# EAGLE design WatchX-BASIC-BOTTOM (EAGLE 9.6.2)
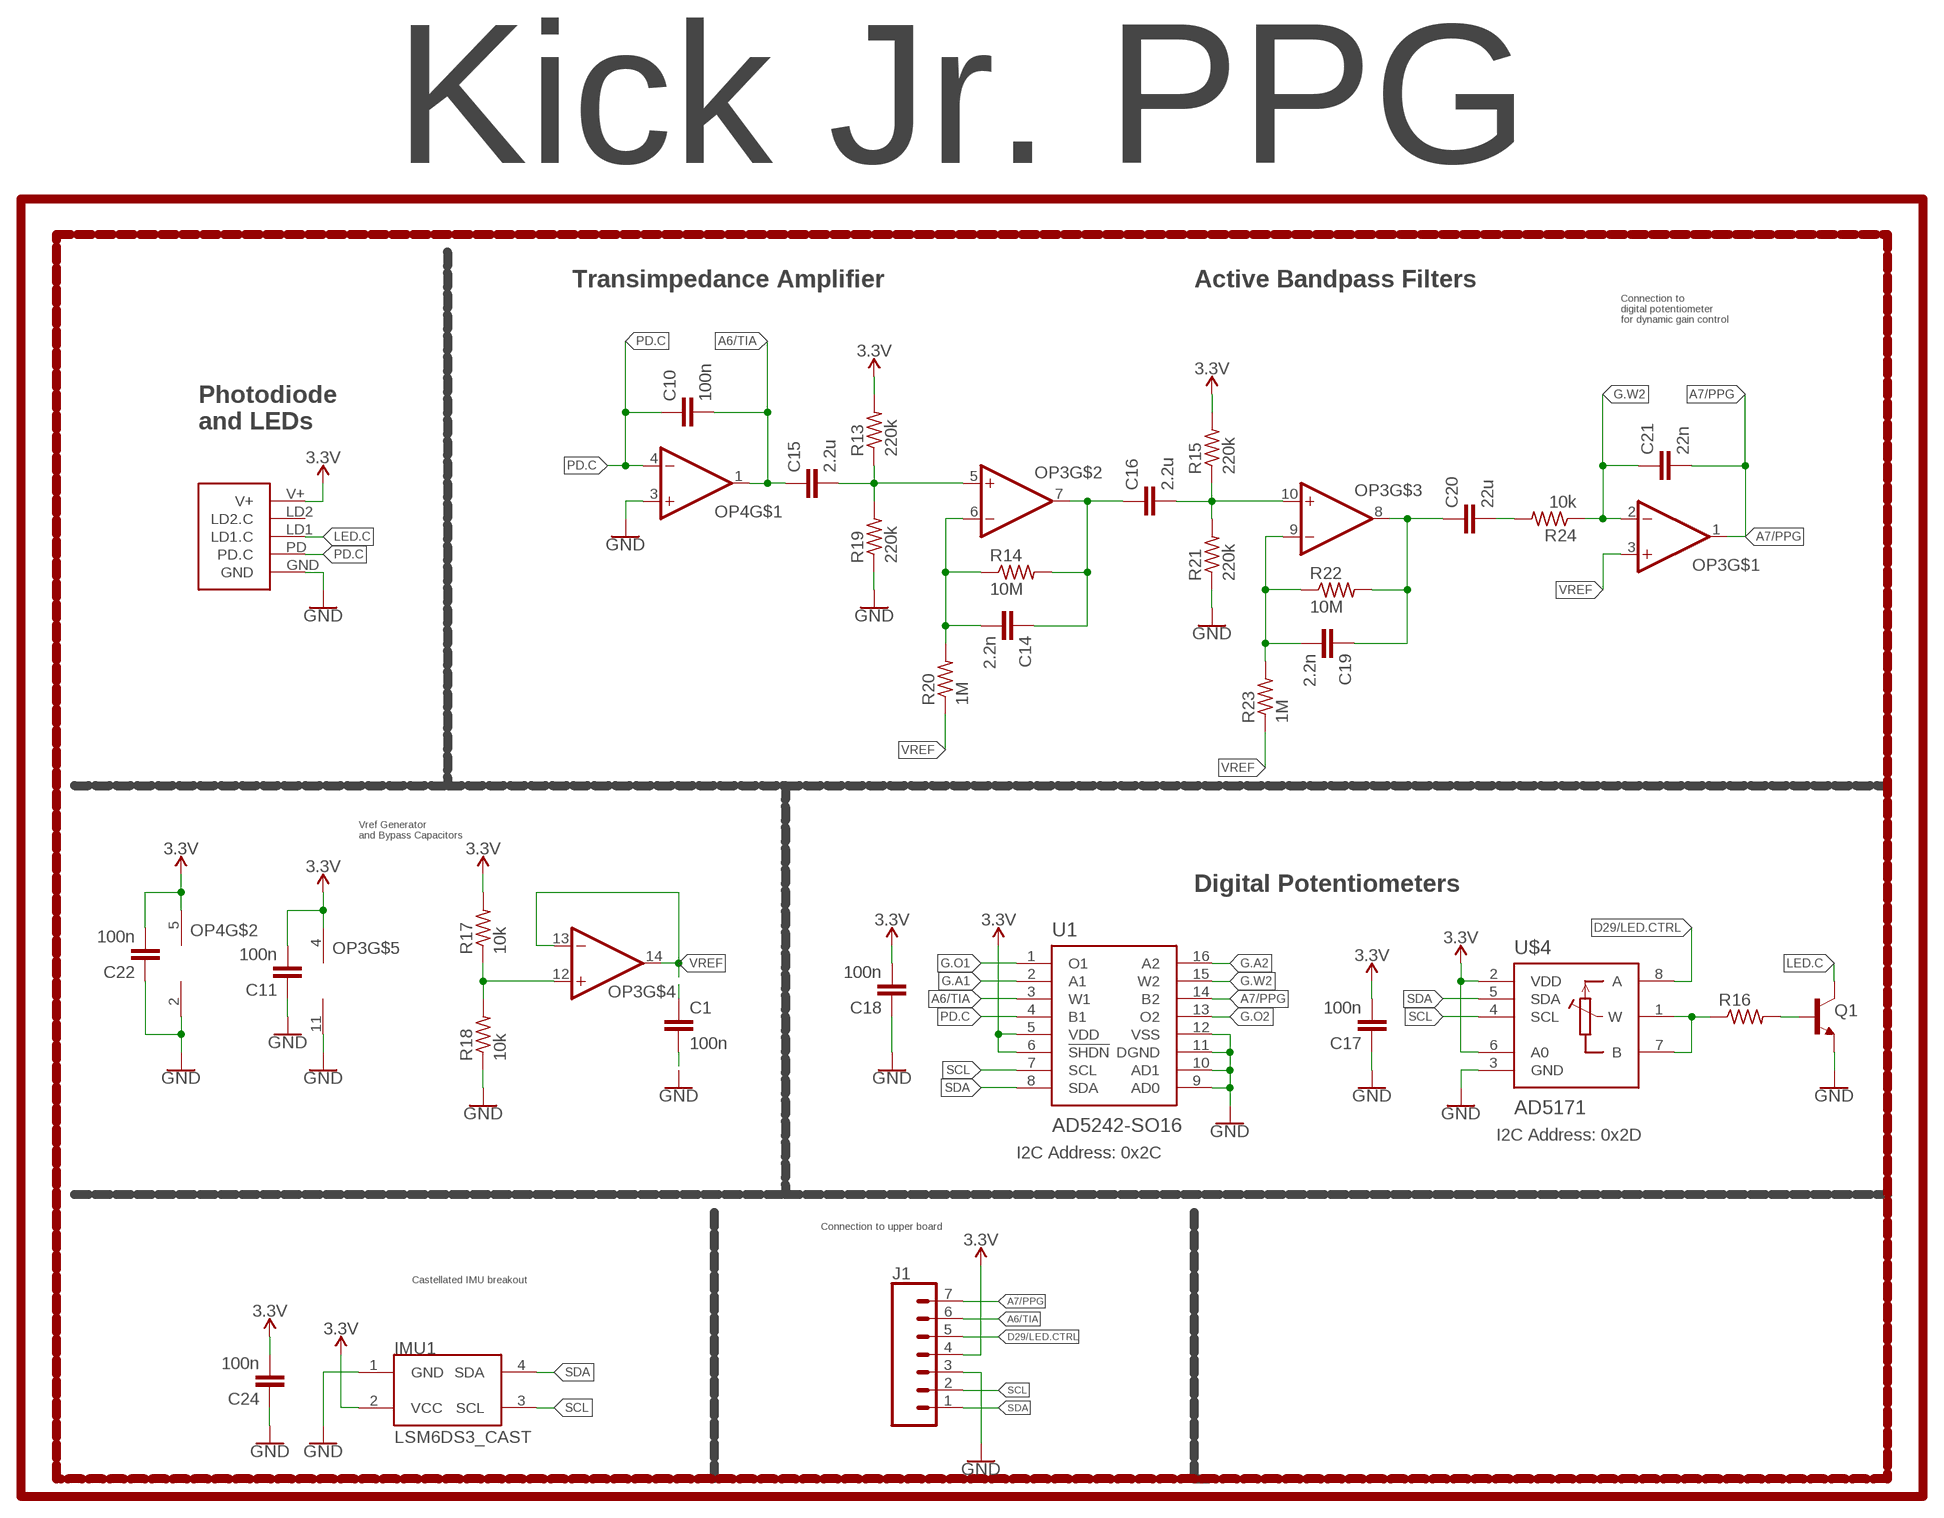
[diagram p0: schematic, sheet 1]

## Parts
C1  100n  CAPACITOR0603  [C0603]
C10  100n  CAPACITOR0603  [C0603]
C11  100n  CAPACITOR0603  [C0603]
C14  2.2n  CAPACITOR0603  [C0603]
C15  2.2u  CAPACITOR0603  [C0603]
C16  2.2u  CAPACITOR0603  [C0603]
C17  100n  CAPACITOR0603  [C0603]
C18  100n  CAPACITOR0603  [C0603]
C19  2.2n  CAPACITOR0603  [C0603]
C20  22u  CAPACITOR0603  [C0603]
C21  22n  CAPACITOR0603  [C0603]
C22  100n  CAPACITOR0603  [C0603]
C24  100n  CAPACITOR0603  [C0603]
IMU1  LSM6DS3_CAST  [LSM6DS3_CAST]
J1  CONN_07-1.27MM  [1X07_1.27MM]
OP3  OP-QUAD-SO14  [SO14]
OP4  OP-SINGLEOT  [SOT23-5]
Q1  NPN-GENERIC  [SOT23-3]
R13  220k  RESISTOR0603  [R0603]
R14  10M  RESISTOR0603  [R0603]
R15  220k  RESISTOR0603  [R0603]
R16  RESISTOR0603  [R0603]
R17  10k  RESISTOR0402  [R0402]
R18  10k  RESISTOR0402  [R0402]
R19  220k  RESISTOR0603  [R0603]
R20  1M  RESISTOR0603  [R0603]
R21  220k  RESISTOR0603  [R0603]
R22  10M  RESISTOR0603  [R0603]
R23  1M  RESISTOR0603  [R0603]
R24  10k  RESISTOR0603  [R0603]
U1  AD5242-SO16  [SO16]
U$3  PPG.MODULE.2  [PPG.MODULE.2]
U$4  AD5171  [SOT-23-8]

## Nets
3.3V: C11.2 C17.2 C18.2 C22.2 C24.2 IMU1.2(VCC) J1.4 OP3.4(V+) OP4.5(V+) R13.2 R15.2 R17.2 U1.5(VDD) U1.6(!SHDN) U$3.V+ U$4.2(VDD) U$4.6(A0)
A6/TIA: C10.2 C15.1 J1.6 OP4.1(OUT) U1.3(W1)
A7/PPG: C21.2 J1.7 OP3.1(OUT) U1.14(B2)
D29/LED.CTRL: J1.5 U$4.8(A)
G.A1: U1.2(A1)
G.A2: U1.16(A2)
G.O1: U1.1(O1)
G.O2: U1.13(O2)
G.W2: C21.1 OP3.2(-IN) R24.1 U1.15(W2)
GND: C1.2 C11.1 C17.1 C18.1 C22.1 C24.1 IMU1.1(GND) J1.3 OP3.11(V-) OP4.2(V-) OP4.3(+IN) Q1.2(E) R18.1 R19.1 R21.1 U1.9(AD0) U1.10(AD1) U1.11(DGND) U1.12(VSS) U$3.GND U$4.3(GND)
LED.C: Q1.3(C) U$3.LD1(LD1.C)
N$8: Q1.1(B) R16.2
N$9: R16.1 U$4.1(W) U$4.7(B)
N$10: OP3.12(+IN) R17.1 R18.2
N$13: C15.2 OP3.5(+IN) R13.1 R19.2
N$15: C14.2 OP3.6(-IN) R14.1 R20.2
N$16: C14.1 C16.1 OP3.7(OUT) R14.2
N$17: C16.2 OP3.10(+IN) R15.1 R21.2
N$18: C19.2 OP3.9(-IN) R22.1 R23.2
N$19: C19.1 C20.1 OP3.8(OUT) R22.2
N$20: C20.2 R24.2
PD.C: C10.1 OP4.4(-IN) U1.4(B1) U$3.PD(PD.C)
SCL: IMU1.3(SCL) J1.2 U1.7(SCL) U$4.4(SCL)
SDA: IMU1.4(SDA) J1.1 U1.8(SDA) U$4.5(SDA)
VREF: C1.1 OP3.3(+IN) OP3.13(-IN) OP3.14(OUT) R20.1 R23.1
Unconnected: U$3.LD2(LD2.C)

## Notes on the sheet
- Kick Jr. PPG
- Transimpedance Amplifier | Active Bandpass Filters
- Connection to 
  digital potentiometer
  for dynamic gain control
- Photodiode
  and LEDs
- Vref Generator 
  and Bypass Capacitors
- Digital Potentiometers
- I2C Address: 0x2D
- I2C Address: 0x2C
- Connection to upper board
- Castellated IMU breakout

## Library data of the parts
C1 C10 C11 C14-C22 C24 = LinnesLab-Passives:CAPACITOR
IMU1 = LinnesLab-Sensors:LSM6DS3_CAST
J1 = LinnesLab-Connectors:CONN_07: Multi connection point. Often used as Generic Header-pin footprint for 0.1 inch spaced/style header connections On any of the 0.1 inch spaced packages, you can populate with these: Break Away Headers - Straight <https://www.sparkfun.com/products/116> (PRT-00116) Break Away Male Headers - Right Angle <https://www.sparkfun.com/products/553> (PRT-00553) Female Headers <https://www.sparkfun.com/products/115> (PRT-00115) Break Away Headers - Machine Pin <https://www.sparkfun.com/products/117> (PRT-00117) Break Away Female Headers - Swiss Machine Pin <https://www.sparkfun.com/products/743> (PRT-00743) For SCREWTERMINALS and SPRING TERMINALS visit here: Screw Terimnals on SparkFun.com <https://www.sparkfun.com/search/results?term=Screw+Terminals> (5mm/3.5mm/2.54mm spacing) This device is also useful as a general connection point to wire up your design to another part of your project. Our various solder wires solder well into these plated through hole pads. Hook-Up Wire - Assortment (Stranded, 22 AWG) <https://www.sparkfun.com/products/11375> (PRT-11375) Hook-Up Wire - Assortment (Solid Core, 22 AWG) <https://www.sparkfun.com/products/11367> (PRT-11367) View the entire wire category on our website here <https://www.sparkfun.com/categories/141> Special notes: Molex polarized connector foot print use with SKU : PRT-08231 with associated crimp pins and housings. 1MM SMD Version SKU: PRT-10208 NOTES ON THE VARIANTS LOCK and LOCK_LONGPADS... This footprint was designed to help hold the alignment of a through-hole component (i.e. 6-pin header) while soldering it into place. You may notice that each hole has been shifted either up or down by 0.005 of an inch from it's more standard position (which is a perfectly straight line). This slight alteration caused the pins (the squares in the middle) to touch the edges of the holes. Because they are alternating, it causes a "brace" to hold the component in place. 0.005 has proven to be the perfect amount of "off-center" position when using our standard breakaway headers. Although looks a little odd when you look at the bare footprint, once you have a header in there, the alteration is very hard to notice. Also,if you push a header all the way into place, it is covered up entirely on the bottom side.
OP3 = LinnesLab-AnalogIC:OP-QUAD: General symbol and footprints for Quad Op Amps. Use with any standard general purpose op amp.
OP4 = LinnesLab-AnalogIC:OP-SINGLE: Single Op Amp 2.7V to 6.0V Single Supply CMOS Source: http://ww1.microchip.com/downloads/en/DeviceDoc/21314g.pdf
Q1 = LinnesLab-DiscreteSemi:NPN
R13-R24 = LinnesLab-Passives:RESISTOR
U1 = LinnesLab-DigitalIC:AD5242
U$3 = LinnesLab-Connectors:PPG.MODULE.2: Digi-Key Part Number: S9014E-50-ND Manufacturer Part Number: GRPB501VWVN-RC Description: 1mm insulation height 0.05in pitch 50 positions
U$4 = LinnesLab-DigitalIC:AD5171

## Board
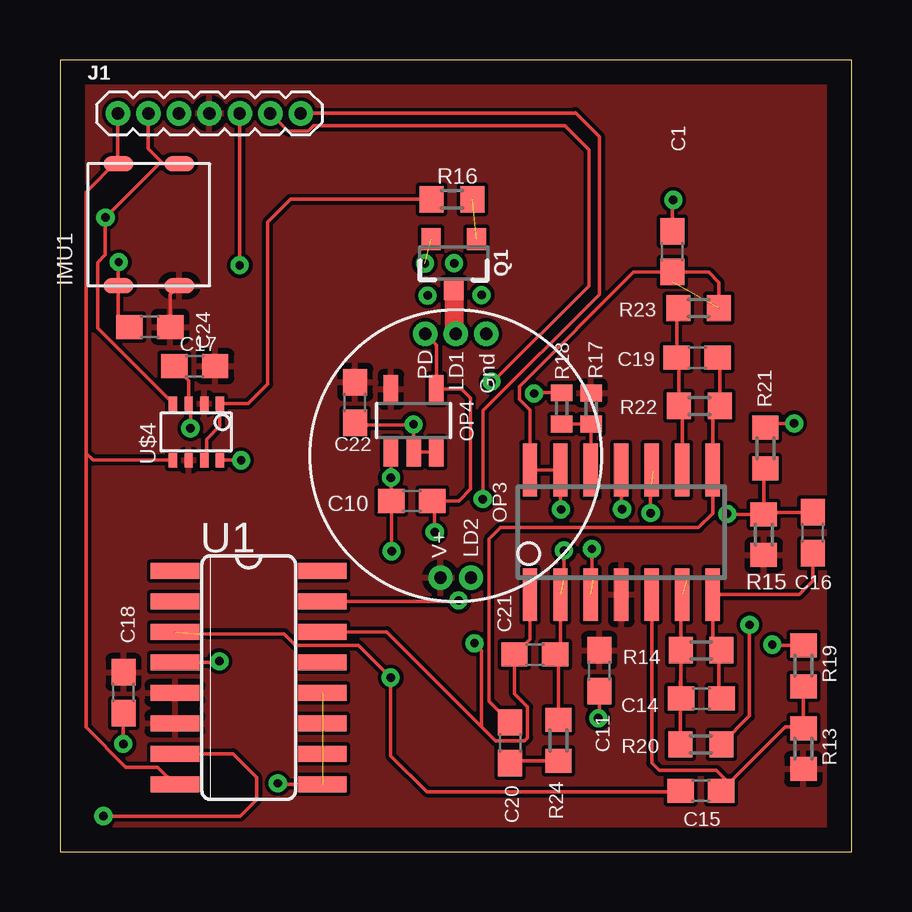
[diagram p1: board, top side]
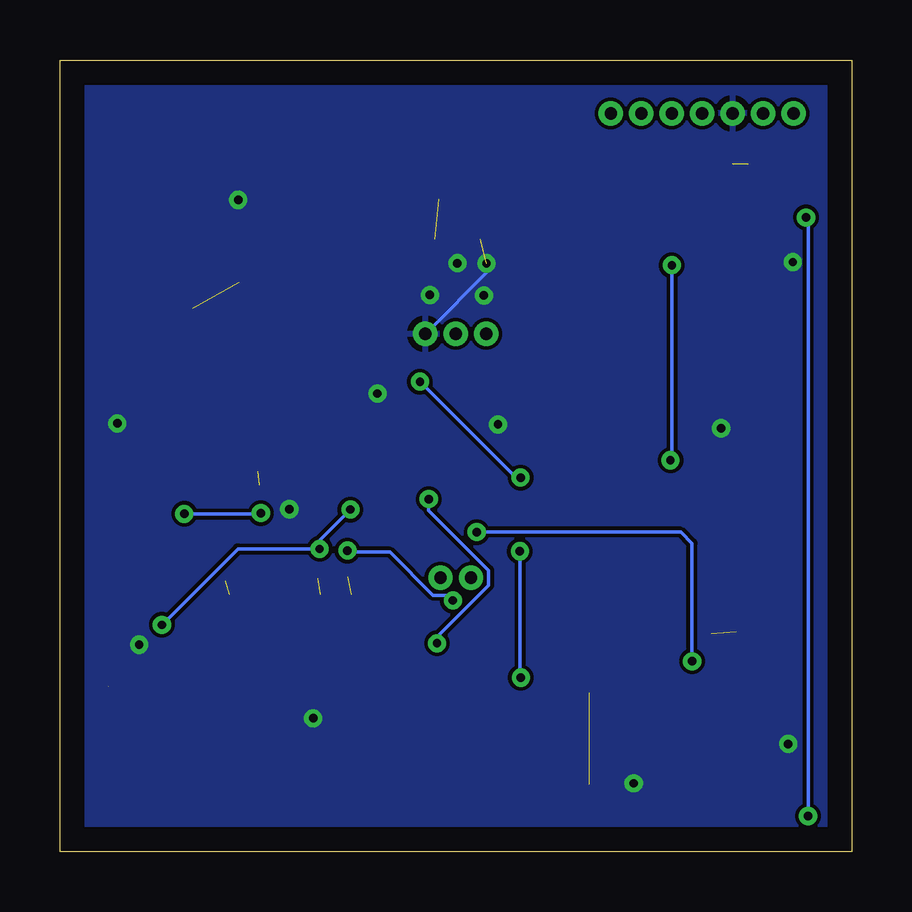
[diagram p2: board, bottom side, seen from below]

Size 33 x 33 mm. Coordinates in mm from the lower left corner, seen from the top.
Outline: 0,0 33,0 33,33 0,33 0,0
Copper layers (1*16): Top 0.035mm / dielectric 1.5mm / Bottom 0.035mm
Design rules "default": minimum track width 6mil, minimum drill 0.35mm, track to track 6mil, track to pad 6mil, pad to pad 6mil, via to via 6mil, smd to smd 6mil, copper to edge 40mil, drill to drill 6mil, minimum pad ring 10mil, minimum via ring 8mil, stop-mask expansion 4mil, vias tented up to drill 0mil, thermal gap 10mil

### Footprints (pad centres in the part's own frame; a part is rotated, then mirrored left to right if it is on the bottom)
C0603 = smd 1.1 x 1: 1 -0.85,0; 2 0.85,0
LSM6DS3_CAST = smd 0.635 x 1.27: 1 -2.54,1.27; 2 -2.54,-1.27; 3 2.54,-1.27; 4 2.54,1.27
1X07_1.27MM = drill 0.508 pad 1: 1 0,0; 2 1.27,0; 3 2.54,0; 4 3.81,0; 5 5.08,0; 6 6.35,0; 7 7.62,0
SO14 = smd 0.6 x 2.2: 1 -3.81,-2.6; 2 -2.54,-2.6; 3 -1.27,-2.6; 4 0,-2.6; 5 1.27,-2.6; 6 2.54,-2.6; 7 3.81,-2.6; 8 3.81,2.6; 9 2.54,2.6; 10 1.27,2.6; 11 0,2.6; 12 -1.27,2.6; 13 -2.54,2.6; 14 -3.81,2.6
SOT23-5 = smd 0.6 x 1.2: 1 -0.95,-1.306; 2 0,-1.306; 3 0.95,-1.306; 4 0.95,1.306; 5 -0.95,1.306
SOT23-3 = smd 0.8 x 0.9: 1 -0.95,-1; 2 0.95,-1; 3 0,1.1
R0603 = smd 1 x 1.1: 1 -0.85,0; 2 0.85,0
R0402 = smd 0.7 x 0.9: 1 -0.65,0; 2 0.65,0
SO16 = smd 0.66 x 2.032: 1 -4.445,-3.073; 2 -3.175,-3.073; 3 -1.905,-3.073; 4 -0.635,-3.073; 5 0.635,-3.073; 6 1.905,-3.073; 7 3.175,-3.073; 8 4.445,-3.073; 9 4.445,3.073; 10 3.175,3.073; 11 1.905,3.073; 12 0.635,3.073; 13 -0.635,3.073; 14 -1.905,3.073; 15 -3.175,3.073; 16 -4.445,3.073
PPG.MODULE.2 = drill 0.508 pad 0.94: GND 1.27,5.08; LD1 0,5.08; LD2 0.635,-5.08; PD -1.27,5.08; V+ -0.635,-5.08
SOT-23-8 = smd 0.35 x 0.6: 1 -0.991,-1.176; 2 -0.341,-1.176; 3 0.309,-1.176; 4 0.959,-1.176; 5 0.959,1.176; 6 0.309,1.176; 7 -0.341,1.176; 8 -0.991,1.176

### Placement (x,y rotation side)
C1  25.53,25.01 90 top
C10  14.67,14.62 180 top
C11  22.48,7.54 90 top
C14  26.74,6.39 180 top
C15  26.72,2.53 0 top
C16  31.38,13.29 90 top
C17  5.62,20.23 0 top
C18  2.65,6.63 90 top
C19  26.56,20.6 180 top
C20  18.76,4.54 270 top
C21  19.8,8.21 180 top
C22  12.31,18.72 90 top
C24  3.75,21.87 0 top
IMU1  3.7,26.13 90 top
J1  2.42,30.77 0 top
OP3  23.4,13.31 0 top
OP4  14.75,17.97 0 top
Q1  16.42,24.53 180 top
R13  31,4.29 270 top
R14  26.73,8.39 0 top
R15  29.34,13.21 270 top
R16  16.35,27.19 0 top
R17  22.14,18.47 90 top
R18  20.92,18.48 270 top
R19  31,7.75 270 top
R20  26.72,4.47 180 top
R21  29.41,16.82 270 top
R22  26.66,18.58 0 top
R23  26.63,22.66 180 top
R24  20.78,4.64 270 top
U1  7.87,7.25 270 top
U$3  16.5,16.5 0 top
U$4  5.68,17.49 180 top

### Tracks (layer width: path | path; a pad name or v marks a point on that pad's centre or on a via)
3.3V
  Top 0.154: C24.2 4.6,23.21 IMU1.2
  pour Top: 0.71,32.56 32.5,32.56 32.5,0.8 0.69,0.8 0.69,32.55
A6/TIA  (via drill 0.35)  (1 unrouted)
  Top 0.152: OP4.1 v13.8,15.59 13.8,14.64 C10.2 13.82,12.53 v13.83,12.52 | C15.1 25.83,2.49 15.29,2.49 13.79,4 v13.79,7.25 12.44,8.6 9.83,8.6 9.35,9.08 5.83,9.08
  Top 0.154: J1.6 9.5,30.04 10.34,30.04 10.57,30.26 21.05,30.26 22.05,29.26 22.05,23.57 18.06,19.59 v17.99,19.59
  Bottom 0.152: v13.83,12.52 13.83,7.29 v13.79,7.25
  Bottom 0.154: v17.99,19.59 13.99,15.59 v13.8,15.59
A7/PPG  (via drill 0.35)
  Top 0.152: OP3.1 19.59,8.85 C21.2 18.95,8.11 18.95,6.57 19.49,6.03 19.49,4.74 19.36,4.61 18.17,4.61 13.62,9.16 U1.14
  Top 0.154: J1.7 21.45,30.77 21.48,30.81 | 21.48,30.81 | 21.48,30.81 22.49,29.8 22.49,23.23 17.64,18.38 17.64,14.71 v17.63,14.69 | v17.28,8.68 17.58,8.38 17.58,5.19 18.17,4.61 19.36,4.61 19.49,4.74 19.49,6.03 18.95,6.57 18.95,8.11
  Bottom 0.154: v17.63,14.69 17.63,14.22 15.13,11.72 15.13,11.1 17.28,8.95 v17.28,8.68
D29/LED.CTRL  (via drill 0.35)
  Top 0.154: J1.5 v7.49,24.45 | v7.55,16.31 U$4.8
  Bottom 0.154: v7.49,24.45 7.49,16.37 v7.55,16.31
G.W2  (via drill 0.35)  (1 unrouted)
  Top 0.152: OP3.2 20.86,8.42 20.78,8.34 | 20.78,8.34 C21.1 | R24.1 20.78,8.34 | U1.15 16.58,10.43 v16.62,10.47 | v21.01,12.55 21.01,11.45
  Bottom 0.152: v16.62,10.47 16.83,10.68 17.44,10.68 19.24,12.49 21.01,12.49 v21.01,12.55
GND  (via drill 0.35)  (4 unrouted)
  Top 0.152: R18.1 19.79,19.13 v19.76,19.09 | OP3.11 23.4,14.3 v23.44,14.27 | R21.1 29.59,17.85 v30.61,17.85 | R19.1 29.73,8.6 v29.7,8.63 | C11.1 22.48,5.6 v22.45,5.56 | C18.1 2.65,5.43 2.64,5.42 v2.64,4.48 | 14.74,17.79 14.74,16.67 OP4.2 OP4.3 | 14.74,17.79 v14.74,17.81 | C22.1 12.39,17.79 14.74,17.79 | U1.9 9.12,2.81 v9.08,2.84 | IMU1.1 2.43,24.56 v2.45,24.57
  Top 0.154: C24.1 2.43,22.33 IMU1.1 | C17.1 5.37,19.63 U$4.3 5.44,18.6 v5.44,17.65 | v25.57,27.17 25.53,27.13 C1.2
  Bottom 0.154: U$3.GND 15.02,24.33 v15.22,24.52
  other vias: 15.33,23.18 17.58,23.21 16.43,24.52
  pour Bottom: 0.96,32.62 32.5,32.62 32.5,0.25 0.42,0.25 0.42,32.59 0.94,32.59 0.94,32.6
LED.C
  Top 0.8: Q1.3 16.42,21.66 U$3.LD1
N$8  (1 unrouted)
N$9
  Top 0.154: R16.1 9.61,27.19 8.66,26.25 8.66,19.5 7.84,18.67 U$4.1 6.67,17.74 6.11,17.18 6.11,16.41 U$4.7
N$10
  Top 0.152: OP3.12 22.14,15.92 R17.1 R18.2
N$13  (1 unrouted)
  Top 0.152: R13.1 31,5.21 | 31,5.21 R19.2 | C15.2 27.76,2.73 30.24,5.21 31,5.21
  Top 0.154: OP3.5 24.67,3.7 24.98,3.38 27.37,3.38 27.76,3 27.76,2.73
N$15  (1 unrouted)
  Top 0.152: R14.1 25.84,8.35 25.89,8.3 25.89,7.13 | 25.89,8.4 R14.1 | C14.2 25.89,7.13 | R14.1 25.88,11.05 26.11,11.28 | R20.2 25.87,7.12 25.89,7.13
N$16
  Top 0.152: 27.54,8.35 R14.2 27.47,8.5 | 27.47,8.5 27.21,8.75 OP3.7 | C14.1 27.47,6.51 27.47,8.5
  Top 0.154: OP3.7 30.81,10.71 31.38,11.28 C16.1
N$17  (via drill 0.35)  (1 unrouted)
  Top 0.152: C16.2 29.42,14.14 R15.1 | R15.1 29.34,15.9 R21.2 | R15.1 29.11,14.29 | 24.75,15.84 OP3.10 | R15.1 27.84,14.06 v27.82,14.08 | v24.62,14.11 24.62,15.22 24.68,15.27
  Bottom 0.152: v27.82,14.08 24.65,14.08 v24.62,14.11
N$18
  Top 0.152: OP3.9 25.94,18.45 R22.1 25.81,20.5 C19.2 25.71,22.59 R23.2
N$19
  Top 0.152: C20.1 17.89,6.26 17.89,13.02 18.37,13.5 26.61,13.5 27.21,14.1 OP3.8 27.21,18.28 R22.2 27.51,20.5 C19.1
N$20
  Top 0.152: C20.2 18.86,3.79 R24.2
PD.C  (via drill 0.35)
  Top 0.152: U$3.PD 15.7,21.11 OP4.4 16.75,19.27 17.12,18.9 17.12,15.11 16.63,14.62 C10.1 15.62,14.52 v15.62,13.32 | U1.4 6.6,7.89 v6.65,7.93
  Bottom 0.152: v6.65,7.93 6.65,12.85 7.12,13.32 v15.62,13.32
SCL  (via drill 0.35)  (1 unrouted)
  Top 0.152: J1.2 3.68,29.29 4.3,28.68
  Top 0.154: U1.7 7.22,4.08 8.19,3.1 8.19,2.15 7.52,1.48 v1.81,1.48 | IMU1.3 4.13,28.67 v1.89,26.43 1.89,24.88 1.57,24.55 1.57,21.82 U$4.4
  Bottom 0.154: v1.81,1.48 1.81,26.29 1.92,26.41 | 1.92,26.41 | 1.92,26.41 v1.89,26.43
SDA
  Top 0.152: J1.1 2.42,28.82 2.42,28.69 IMU1.4
  Top 0.154: U1.8 4.08,3.52 2.75,3.52 1.09,5.17 1.09,16.6 | 2.42,28.82 1.09,27.49 1.09,16.6 | U$4.5 1.38,16.32 1.09,16.6
VREF  (via drill 0.35)  (2 unrouted)
  Top 0.152: OP3.14 OP3.13
  Top 0.154: R23.1 27.48,23.71 27.04,24.15 23.91,24.15 19.16,19.39 19.16,18.84 19.59,18.41 OP3.14 19.59,17.8 | R20.1 28.75,5.65 v28.75,9.45 | v22.18,12.62 22.18,11.45 22.23,11.39 | OP3.13 20.86,14.29 v20.89,14.26 | C1.1 25.53,23.73
  Bottom 0.154: v28.75,9.45 25.58,12.62 v22.19,12.62 | v22.19,12.62 v22.18,12.62 | v20.89,14.26 22.19,12.96 v22.19,12.62